# Altium schematic sheet MCU.SchDoc
size A; SheetNumber: 7; SheetTotal: 7
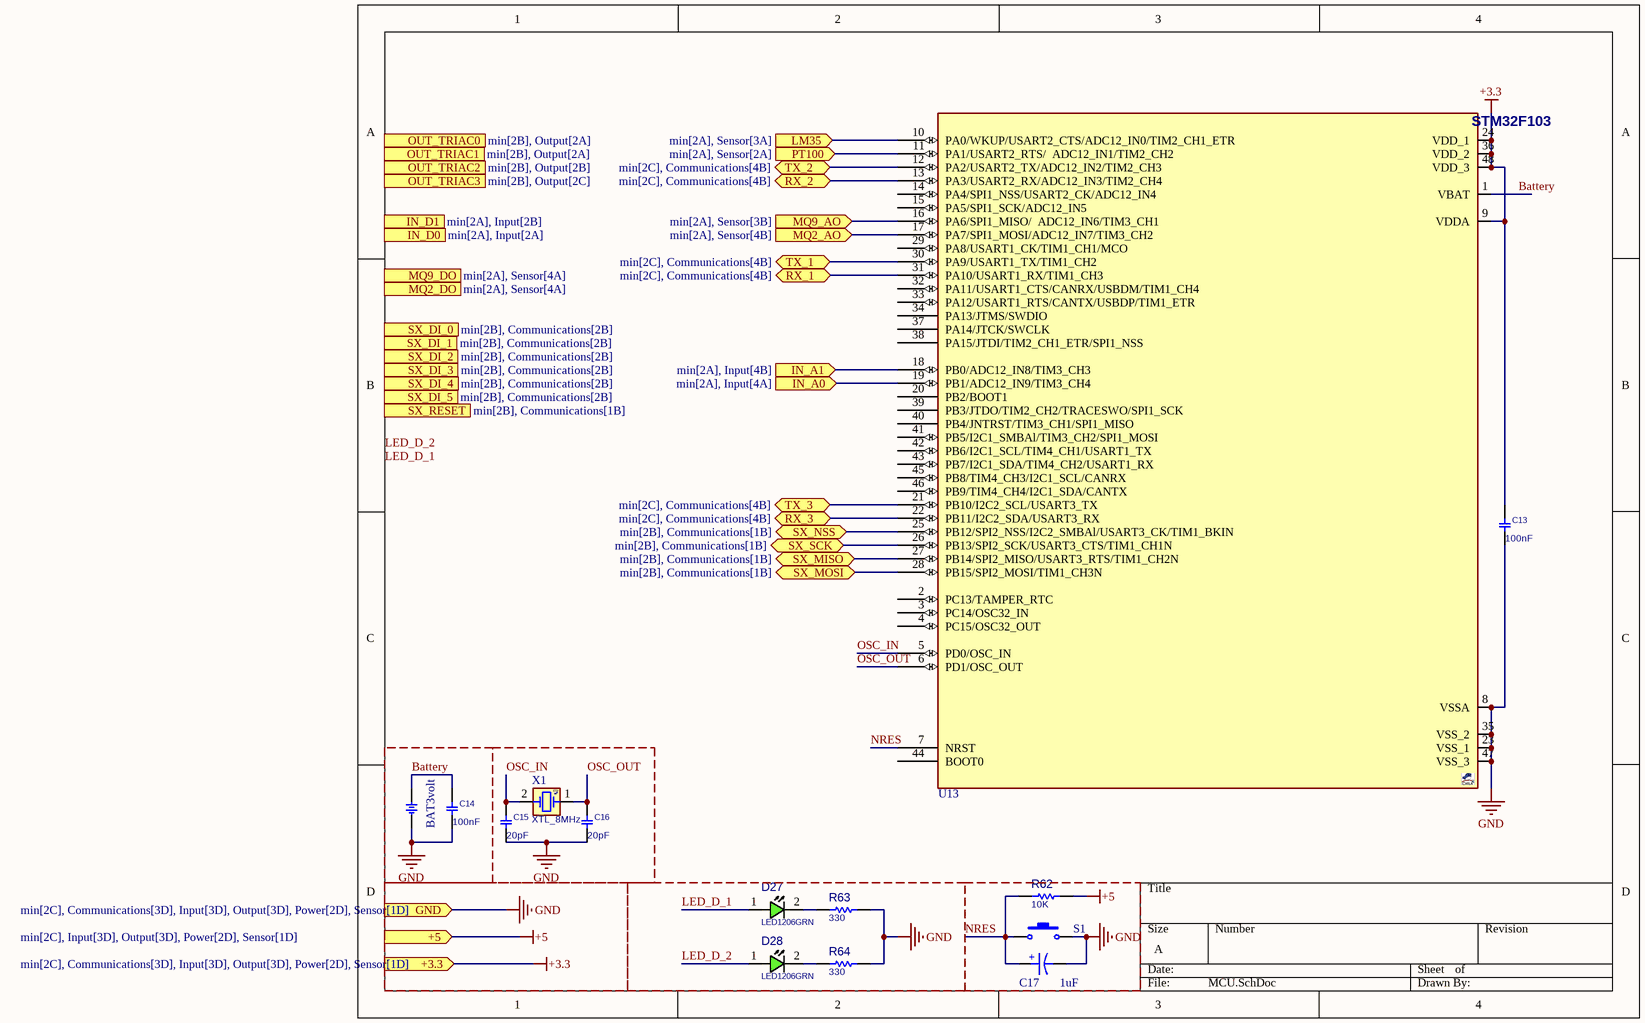
[diagram p0: MCU.SchDoc]

## Parts
BT1  BAT3volt  [BTH1632_BH600]
C13  100nF  [C1206]
C14  100nF  [C1206]
C15  20pF  [C1206]
C16  20pF  [C1206]
C17  1uF  [Cap electrolitic radial 10x20-5]
D27  LED1206GRN  [LED1206GRN]
D28  LED1206GRN  [LED1206GRN]
R62  10K  [R1206]
R63  330  [R1206]
R64  330  [R1206]
S1  Switch PB  [Switch - Push to On]  (value not drawn)
U13  STM32F103  [QFG50_48]  (value not drawn)
X1  XTL_8MHz  [XTL_2_11X5]

## Ports
+3.3 (in, see min[2C], Communications[3D], Input[3D], Output[3D], Power[2D], Sensor[1D]), +5 (in, see min[2C], Input[3D], Output[3D], Power[2D], Sensor[1D]), GND (in, see min[2C], Communications[3D], Input[3D], Output[3D], Power[2D], Sensor[1D]), IN_A0 (in, see min[2A], Input[4A]), IN_A1 (in, see min[2A], Input[4B]), IN_D0 (in, see min[2A], Input[2A]), IN_D1 (in, see min[2A], Input[2B]), LM35 (in, see min[2A], Sensor[3A]), MQ2_AO (in, see min[2A], Sensor[4B]), MQ2_DO (in, see min[2A], Sensor[4A]), MQ9_AO (in, see min[2A], Sensor[3B]), MQ9_DO (in, see min[2A], Sensor[4A]), OUT_TRIAC0 (out, see min[2B], Output[2A]), OUT_TRIAC1 (out, see min[2B], Output[2A]), OUT_TRIAC2 (out, see min[2B], Output[2B]), OUT_TRIAC3 (out, see min[2B], Output[2C]), PT100 (in, see min[2A], Sensor[2A]), RX_1 (bidir, see min[2C], Communications[4B]), RX_2 (bidir, see min[2C], Communications[4B]), RX_3 (bidir, see min[2C], Communications[4B]), SX_DI_0 (in, see min[2B], Communications[2B]), SX_DI_1 (in, see min[2B], Communications[2B]), SX_DI_2 (in, see min[2B], Communications[2B]), SX_DI_3 (in, see min[2B], Communications[2B]), SX_DI_4 (in, see min[2B], Communications[2B]), SX_DI_5 (in, see min[2B], Communications[2B]), SX_MISO (bidir, see min[2B], Communications[1B]), SX_MOSI (bidir, see min[2B], Communications[1B]), SX_NSS (bidir, see min[2B], Communications[1B]), SX_RESET (out, see min[2B], Communications[1B]), SX_SCK (bidir, see min[2B], Communications[1B]), TX_1 (bidir, see min[2C], Communications[4B]), TX_2 (bidir, see min[2C], Communications[4B]), TX_3 (bidir, see min[2C], Communications[4B])

## Nets
+3.3: C13.1 U13.9(VDDA) U13.24(VDD_1) U13.36(VDD_2) U13.48(VDD_3) ; port +3.3
+5: R62.2 ; port +5
GND: BT1.2 C13.2 C14.2 C15.2 C16.2 C17.2 R63.2 R64.2 S1.2 U13.8(VSSA) U13.23(VSS_1) U13.35(VSS_2) U13.47(VSS_3) ; port GND
Battery: BT1.1 C14.1 U13.1(VBAT)
IN_A0: U13.19(PB1/ADC12_IN9/TIM3_CH4) ; port IN_A0
IN_A1: U13.18(PB0/ADC12_IN8/TIM3_CH3) ; port IN_A1
LED_D_1: D27.1(ANODE)
LED_D_2: D28.1(ANODE)
LM35: U13.10(PA0/WKUP/USART2_CTS/ADC12_IN0/TIM2_CH1_ETR) ; port LM35
MQ2_AO: U13.17(PA7/SPI1_MOSI/ADC12_IN7/TIM3_CH2) ; port MQ2_AO
MQ9_AO: U13.16(PA6/SPI1_MISO/__ADC12_IN6/TIM3_CH1) ; port MQ9_AO
NRES: C17.1 R62.1 S1.1 U13.7(NRST)
OSC_IN: C15.1 U13.5(PD0/OSC_IN) X1.2(OSC2)
OSC_OUT: C16.1 U13.6(PD1/OSC_OUT) X1.1(OSC1)
PT100: U13.11(PA1/USART2_RTS/__ADC12_IN1/TIM2_CH2) ; port PT100
RX_1: U13.31(PA10/USART1_RX/TIM1_CH3) ; port RX_1
RX_2: U13.13(PA3/USART2_RX/ADC12_IN3/TIM2_CH4) ; port RX_2
RX_3: U13.22(PB11/I2C2_SDA/USART3_RX) ; port RX_3
SX_MISO: U13.27(PB14/SPI2_MISO/USART3_RTS/TIM1_CH2N) ; port SX_MISO
SX_MOSI: U13.28(PB15/SPI2_MOSI/TIM1_CH3N) ; port SX_MOSI
SX_NSS: U13.25(PB12/SPI2_NSS/I2C2_SMBAl/USART3_CK/TIM1_BKIN) ; port SX_NSS
SX_SCK: U13.26(PB13/SPI2_SCK/USART3_CTS/TIM1_CH1N) ; port SX_SCK
TX_1: U13.30(PA9/USART1_TX/TIM1_CH2) ; port TX_1
TX_2: U13.12(PA2/USART2_TX/ADC12_IN2/TIM2_CH3) ; port TX_2
TX_3: U13.21(PB10/I2C2_SCL/USART3_TX) ; port TX_3
NetD27_2: D27.2(CATHODE) R63.1
NetD28_2: D28.2(CATHODE) R64.1

Not connected (* = marked no-connect by the designer): U13 2(PC13/TAMPER_RTC) 3(PC14/OSC32_IN) 4(PC15/OSC32_OUT) 14(PA4/SPI1_NSS/USART2_CK/ADC12_IN4) 15(PA5/SPI1_SCK/ADC12_IN5) 20(PB2/BOOT1) 29(PA8/USART1_CK/TIM1_CH1/MCO) 32(PA11/USART1_CTS/CANRX/USBDM/TIM1_CH4) 33(PA12/USART1_RTS/CANTX/USBDP/TIM1_ETR) 34(PA13/JTMS/SWDIO) 37(PA14/JTCK/SWCLK) 38(PA15/JTDI/TIM2_CH1_ETR/SPI1_NSS) 39(PB3/JTDO/TIM2_CH2/TRACESWO/SPI1_SCK) 40(PB4/JNTRST/TIM3_CH1/SPI1_MISO) 41(PB5/I2C1_SMBAl/TIM3_CH2/SPI1_MOSI) 42(PB6/I2C1_SCL/TIM4_CH1/USART1_TX) 43(PB7/I2C1_SDA/TIM4_CH2/USART1_RX) 44(BOOT0) 45(PB8/TIM4_CH3/I2C1_SCL/CANRX) 46(PB9/TIM4_CH4/I2C1_SDA/CANTX)

## Notes on the sheet
- Labels drawn without touching a wire or pin: LED_D_1, LED_D_2
- (in symbol Cap electrolitic radial 10x21) +

## Library data of the parts
BT1 = BATH_CR1632: BATTERY HOLDER, CR1632 CR1620 CR1616; MANF_P#: BH600; .: http://www.chila.ir; VALUE: BAT3volt
C13 C14 = CAP_SMD_MLCC: CAP, MLCC; PARAM: C0G, 10%; DESC: CAP, MLCC, 1nF, 50V, C0G, 10%, 0402; MANF_P#: MANF_PART#; MANF: Murata; PARAM2: 50V; VALUE: 20pF; PRICE: 100= 1$; ASSEMBLY: ASSEMBLY
C15 C16 = CAP_SMD_MLCC: CAP, MLCC; PARAM: C0G, 10%; DESC: CAP, MLCC, 1nF, 50V, C0G, 10%, 0402; MANF_P#: MANF_PART#; MANF: Murata; PARAM2: 50V; PRICE: 100= 1$; ASSEMBLY: ASSEMBLY; VALUE: 20pF
C17 = Cap electrolitic radial 10x21: Cap electrolitic radial; Part. No: 100U/50V; Designer: Abbas Basereh; Data: 16-12-2016
D27 D28 = LED_SMD_1206_GRN: LED, SMD, 1206, GREEN; PARAM: 20mA; DESC: DESCRIPTION; PARAM2: 2.2V; MANF: -; ASSEMBLY: ASSEMBLY; PRICE: 36t@Javan; MANF_P#: -; VALUE: LED1206GRN
R62-R64 = RES_SMD: RESISTOR, SMD; PARAM: -W; DESC: DESCRIPTION; DIST#: MOUSER; PARAM2: 1%; VALUE: 470; MANF_P#: -; MANF: -; ASSEMBLY: ASSEMBLY; PRICE: 100= 0.5$
S1 = Switch PB: Push Button Switch
U13 = STM32F103C8T6_QFP48: MCU, STM32 ARM 32-bit, Cortex M3, 64KB FLASH, 20KB SRAM; DESC: CAN, I2C, SPI, USART, USB; MANF: ST; PARAM2: 2~3.6VCC, 72MHz, 2X12Bit ADC; PARAM: 64KB FLASH, 20KB SRAM, -40~85oC; MANF_P#: STM32F103C8T6; PRICE: 6$; VALUE: STM32F103; PACKAGE: QFP-48
X1 = XTL_2_HC49_8MHz_SMD: Crystal MOST POPULAR ABL HC49 PACKAGE; MANF: ABRACON; MANF_P#: ABLS-8.000MHZ-B4-T; PARAM: 8MHz, 18pF, 30PPM, -20~70oC; PRICE: 0.3$; VALUE: XTL_8MHz